# EasyEDA schematic Solder practice.json
TITLE: Solder practice; REV: 1.0; Date: 2023-02-27; Sheet: 1/1; Drawn By: philbobagins
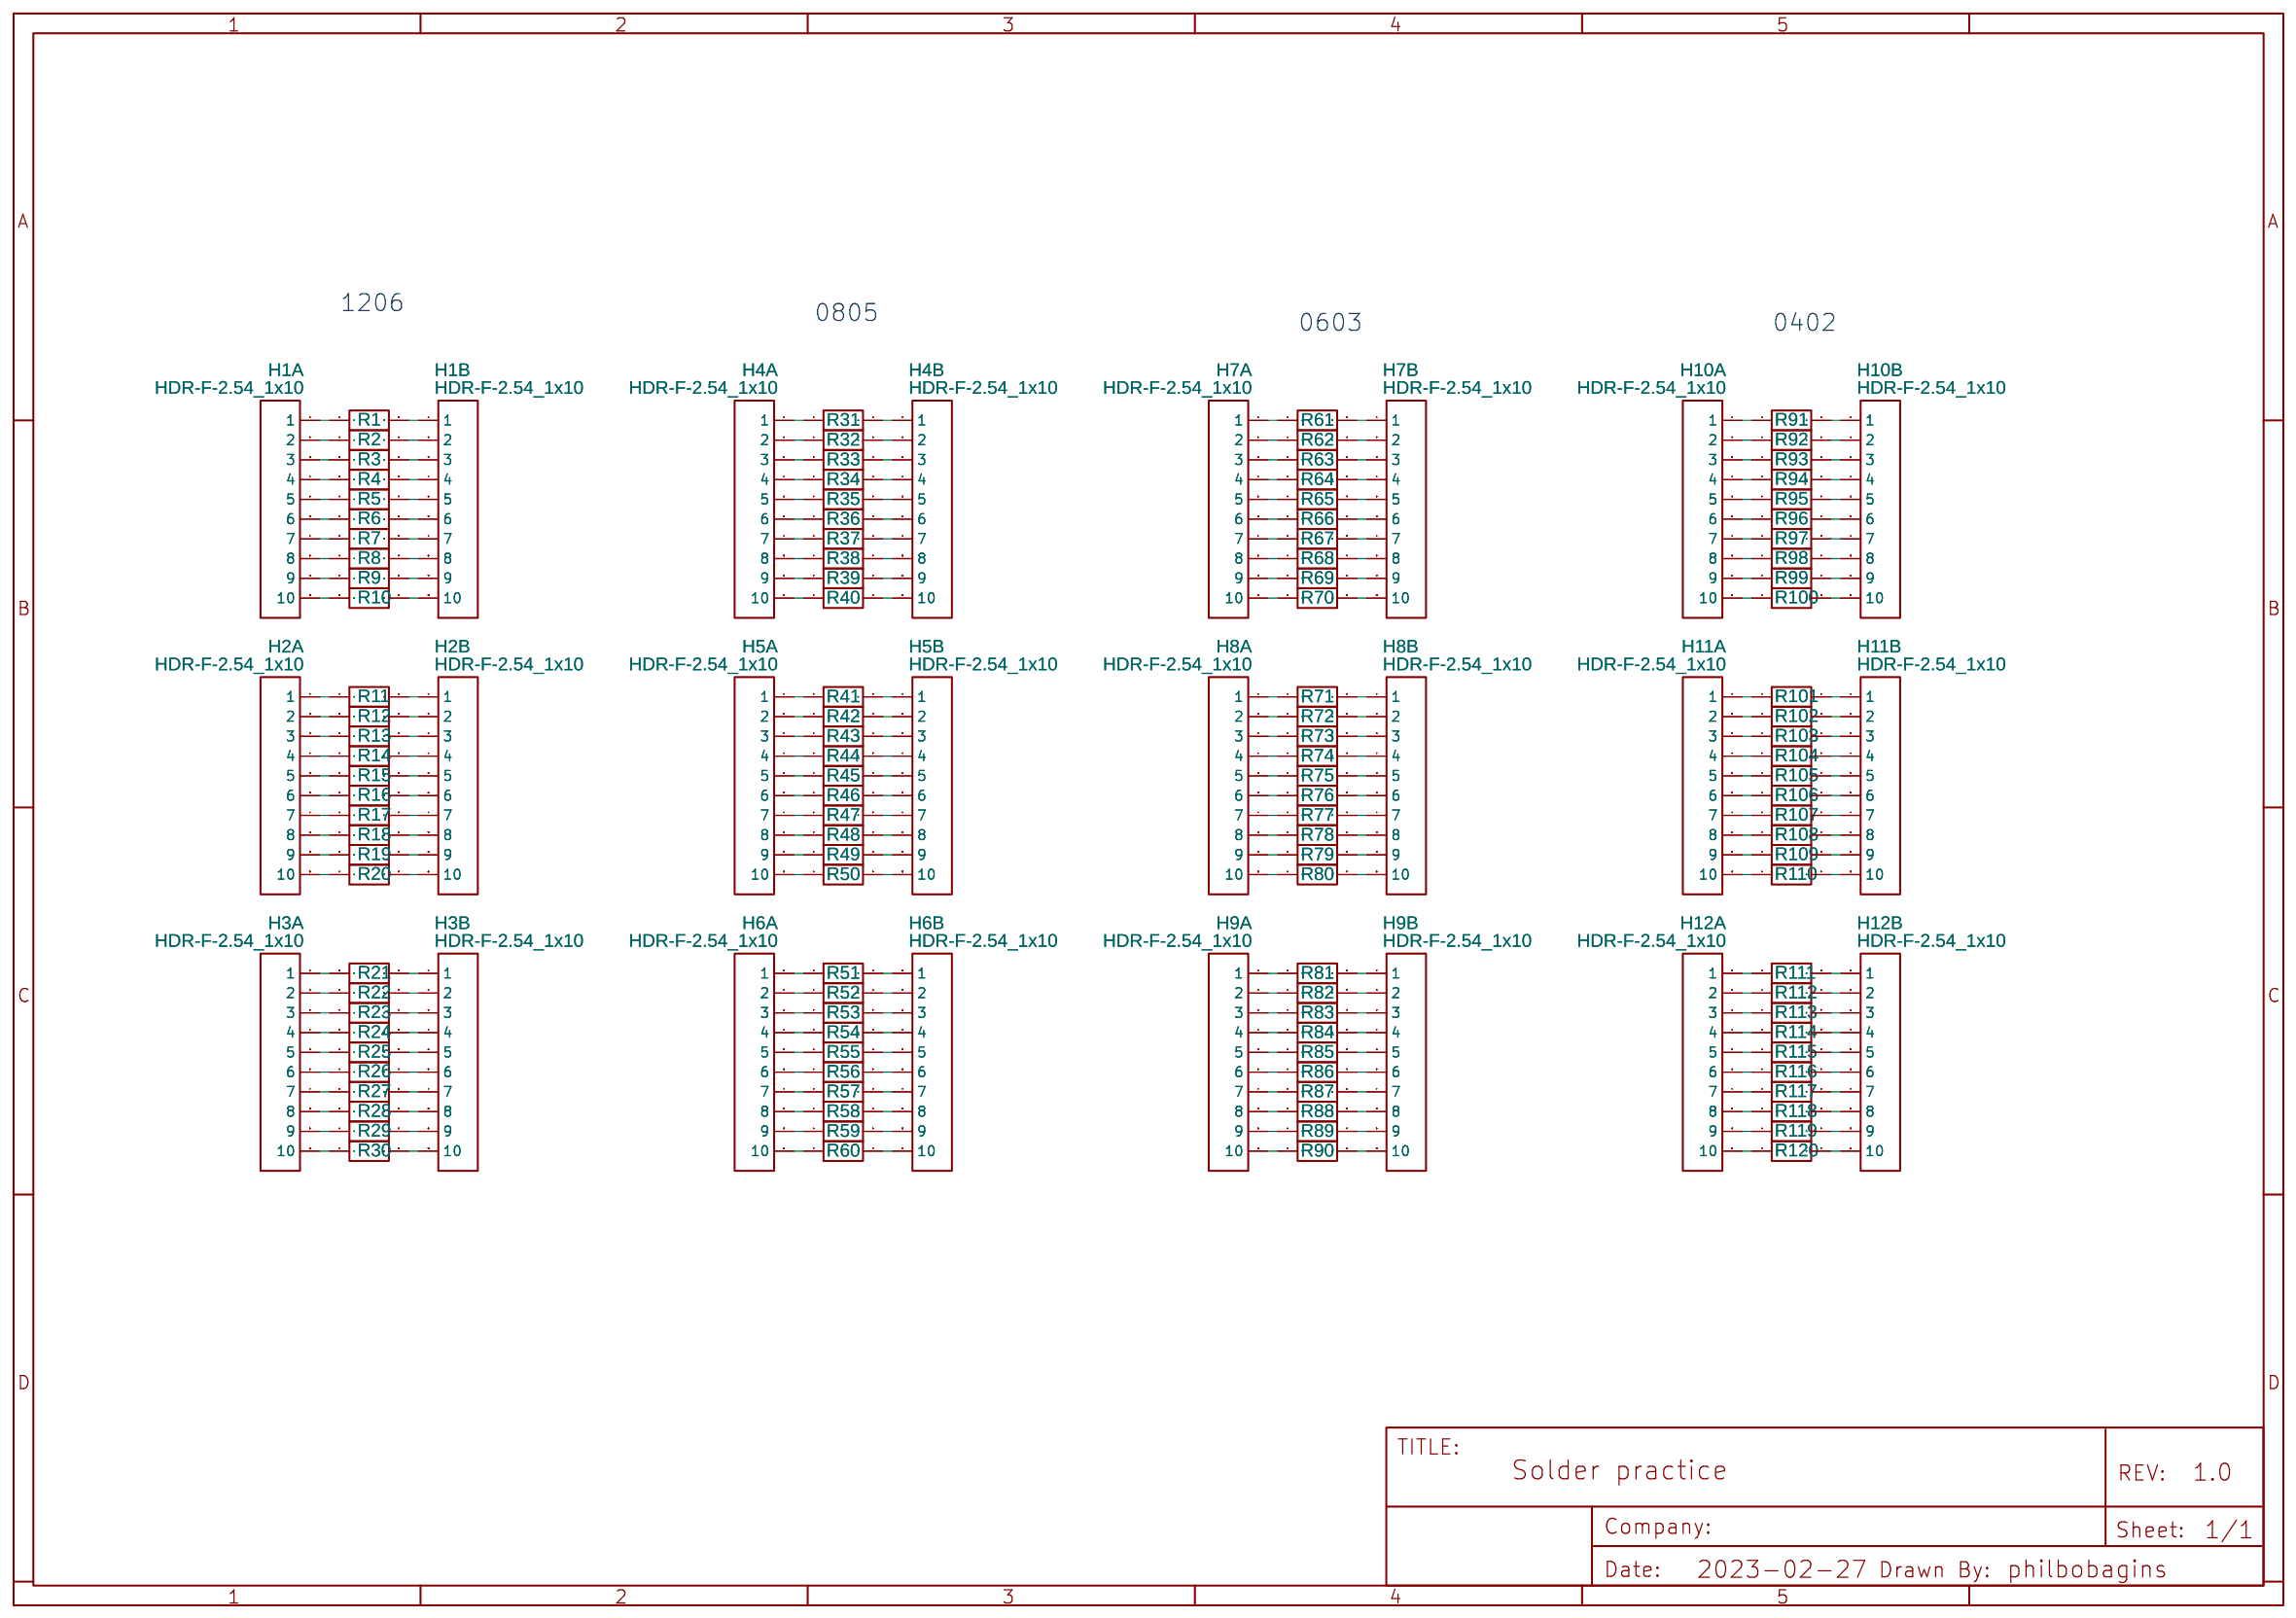
[diagram p0: schematic sheet]

## Parts
H1A  HDR-F-2.54_1x10  [HDR-F-2.54_1X10]
H1B  HDR-F-2.54_1x10  [HDR-F-2.54_1X10]
H2A  HDR-F-2.54_1x10  [HDR-F-2.54_1X10]
H2B  HDR-F-2.54_1x10  [HDR-F-2.54_1X10]
H3A  HDR-F-2.54_1x10  [HDR-F-2.54_1X10]
H3B  HDR-F-2.54_1x10  [HDR-F-2.54_1X10]
H4A  HDR-F-2.54_1x10  [HDR-F-2.54_1X10]
H4B  HDR-F-2.54_1x10  [HDR-F-2.54_1X10]
H5A  HDR-F-2.54_1x10  [HDR-F-2.54_1X10]
H5B  HDR-F-2.54_1x10  [HDR-F-2.54_1X10]
H6A  HDR-F-2.54_1x10  [HDR-F-2.54_1X10]
H6B  HDR-F-2.54_1x10  [HDR-F-2.54_1X10]
H7A  HDR-F-2.54_1x10  [HDR-F-2.54_1X10]
H7B  HDR-F-2.54_1x10  [HDR-F-2.54_1X10]
H8A  HDR-F-2.54_1x10  [HDR-F-2.54_1X10]
H8B  HDR-F-2.54_1x10  [HDR-F-2.54_1X10]
H9A  HDR-F-2.54_1x10  [HDR-F-2.54_1X10]
H9B  HDR-F-2.54_1x10  [HDR-F-2.54_1X10]
H10A  HDR-F-2.54_1x10  [HDR-F-2.54_1X10]
H10B  HDR-F-2.54_1x10  [HDR-F-2.54_1X10]
H11A  HDR-F-2.54_1x10  [HDR-F-2.54_1X10]
H11B  HDR-F-2.54_1x10  [HDR-F-2.54_1X10]
H12A  HDR-F-2.54_1x10  [HDR-F-2.54_1X10]
H12B  HDR-F-2.54_1x10  [HDR-F-2.54_1X10]
R1  1k  [R1206]
R2  1k  [R1206]
R3  1k  [R1206]
R4  1k  [R1206]
R5  1k  [R1206]
R6  1k  [R1206]
R7  1k  [R1206]
R8  1k  [R1206]
R9  1k  [R1206]
R10  1k  [R1206]
R11  1k  [R1206]
R12  1k  [R1206]
R13  1k  [R1206]
R14  1k  [R1206]
R15  1k  [R1206]
R16  1k  [R1206]
R17  1k  [R1206]
R18  1k  [R1206]
R19  1k  [R1206]
R20  1k  [R1206]
R21  1k  [R1206]
R22  1k  [R1206]
R23  1k  [R1206]
R24  1k  [R1206]
R25  1k  [R1206]
R26  1k  [R1206]
R27  1k  [R1206]
R28  1k  [R1206]
R29  1k  [R1206]
R30  1k  [R1206]
R31  1k  [R0805]
R32  1k  [R0805]
R33  1k  [R0805]
R34  1k  [R0805]
R35  1k  [R0805]
R36  1k  [R0805]
R37  1k  [R0805]
R38  1k  [R0805]
R39  1k  [R0805]
R40  1k  [R0805]
R41  1k  [R0805]
R42  1k  [R0805]
R43  1k  [R0805]
R44  1k  [R0805]
R45  1k  [R0805]
R46  1k  [R0805]
R47  1k  [R0805]
R48  1k  [R0805]
R49  1k  [R0805]
R50  1k  [R0805]
R51  1k  [R0805]
R52  1k  [R0805]
R53  1k  [R0805]
R54  1k  [R0805]
R55  1k  [R0805]
R56  1k  [R0805]
R57  1k  [R0805]
R58  1k  [R0805]
R59  1k  [R0805]
R60  1k  [R0805]
R61  1k  [R0603]
R62  1k  [R0603]
R63  1k  [R0603]
R64  1k  [R0603]
R65  1k  [R0603]
R66  1k  [R0603]
R67  1k  [R0603]
R68  1k  [R0603]
R69  1k  [R0603]
R70  1k  [R0603]
R71  1k  [R0603]
R72  1k  [R0603]
R73  1k  [R0603]
R74  1k  [R0603]
R75  1k  [R0603]
R76  1k  [R0603]
R77  1k  [R0603]
R78  1k  [R0603]
R79  1k  [R0603]
R80  1k  [R0603]
R81  1k  [R0603]
R82  1k  [R0603]
R83  1k  [R0603]
R84  1k  [R0603]
R85  1k  [R0603]
R86  1k  [R0603]
R87  1k  [R0603]
R88  1k  [R0603]
R89  1k  [R0603]
R90  1k  [R0603]
R91  1k  [R0402]
R92  1k  [R0402]
R93  1k  [R0402]
R94  1k  [R0402]
R95  1k  [R0402]
R96  1k  [R0402]
R97  1k  [R0402]
R98  1k  [R0402]
R99  1k  [R0402]
R100  1k  [R0402]
R101  1k  [R0402]
R102  1k  [R0402]
R103  1k  [R0402]
R104  1k  [R0402]
R105  1k  [R0402]
R106  1k  [R0402]
R107  1k  [R0402]
R108  1k  [R0402]
R109  1k  [R0402]
R110  1k  [R0402]
R111  1k  [R0402]
R112  1k  [R0402]
R113  1k  [R0402]
R114  1k  [R0402]
R115  1k  [R0402]
R116  1k  [R0402]
R117  1k  [R0402]
R118  1k  [R0402]
R119  1k  [R0402]
R120  1k  [R0402]

## Library data of the parts
H1A H1B H2A H2B H3A H3B H4A H4B H5A H5B H6A H6B H7A H7B H8A H8B H9A H9B H10A H10B H11A H11B H12A H12B = HDR-F-2.54_1x10: Supplier Part: C35445; Supplier: LCSC; Contributor: LCEDA_Lib
R1-R30 = R_1206_EU: Contributor: LCEDA_Lib
R31-R60 = R_0805_EU: Contributor: LCEDA_Lib
R61-R90 = R_0603_EU: Contributor: LCEDA_Lib
R91-R120 = R_0402_EU: Contributor: LCEDA_Lib

## Nets
Net-(H1A-1): H1A.1 R1.1
Net-(H1A-2): H1A.2 R2.1
Net-(H1A-3): H1A.3 R3.1
Net-(H1A-4): H1A.4 R4.1
Net-(H1A-5): H1A.5 R5.1
Net-(H1A-6): H1A.6 R6.1
Net-(H1A-7): H1A.7 R7.1
Net-(H1A-8): H1A.8 R8.1
Net-(H1A-9): H1A.9 R9.1
Net-(H1A-10): H1A.10 R10.1
Net-(H1B-1): H1B.1 R1.2
Net-(H1B-2): H1B.2 R2.2
Net-(H1B-3): H1B.3 R3.2
Net-(H1B-4): H1B.4 R4.2
Net-(H1B-5): H1B.5 R5.2
Net-(H1B-6): H1B.6 R6.2
Net-(H1B-7): H1B.7 R7.2
Net-(H1B-8): H1B.8 R8.2
Net-(H1B-9): H1B.9 R9.2
Net-(H1B-10): H1B.10 R10.2
Net-(H2A-1): H2A.1 R11.1
Net-(H2A-2): H2A.2 R12.1
Net-(H2A-3): H2A.3 R13.1
Net-(H2A-4): H2A.4 R14.1
Net-(H2A-5): H2A.5 R15.1
Net-(H2A-6): H2A.6 R16.1
Net-(H2A-7): H2A.7 R17.1
Net-(H2A-8): H2A.8 R18.1
Net-(H2A-9): H2A.9 R19.1
Net-(H2A-10): H2A.10 R20.1
Net-(H2B-1): H2B.1 R11.2
Net-(H2B-2): H2B.2 R12.2
Net-(H2B-3): H2B.3 R13.2
Net-(H2B-4): H2B.4 R14.2
Net-(H2B-5): H2B.5 R15.2
Net-(H2B-6): H2B.6 R16.2
Net-(H2B-7): H2B.7 R17.2
Net-(H2B-8): H2B.8 R18.2
Net-(H2B-9): H2B.9 R19.2
Net-(H2B-10): H2B.10 R20.2
Net-(H3A-1): H3A.1 R21.1
Net-(H3A-2): H3A.2 R22.1
Net-(H3A-3): H3A.3 R23.1
Net-(H3A-4): H3A.4 R24.1
Net-(H3A-5): H3A.5 R25.1
Net-(H3A-6): H3A.6 R26.1
Net-(H3A-7): H3A.7 R27.1
Net-(H3A-8): H3A.8 R28.1
Net-(H3A-9): H3A.9 R29.1
Net-(H3A-10): H3A.10 R30.1
Net-(H3B-1): H3B.1 R21.2
Net-(H3B-2): H3B.2 R22.2
Net-(H3B-3): H3B.3 R23.2
Net-(H3B-4): H3B.4 R24.2
Net-(H3B-5): H3B.5 R25.2
Net-(H3B-6): H3B.6 R26.2
Net-(H3B-7): H3B.7 R27.2
Net-(H3B-8): H3B.8 R28.2
Net-(H3B-9): H3B.9 R29.2
Net-(H3B-10): H3B.10 R30.2
Net-(H4A-1): H4A.1 R31.1
Net-(H4A-2): H4A.2 R32.1
Net-(H4A-3): H4A.3 R33.1
Net-(H4A-4): H4A.4 R34.1
Net-(H4A-5): H4A.5 R35.1
Net-(H4A-6): H4A.6 R36.1
Net-(H4A-7): H4A.7 R37.1
Net-(H4A-8): H4A.8 R38.1
Net-(H4A-9): H4A.9 R39.1
Net-(H4A-10): H4A.10 R40.1
Net-(H4B-1): H4B.1 R31.2
Net-(H4B-2): H4B.2 R32.2
Net-(H4B-3): H4B.3 R33.2
Net-(H4B-4): H4B.4 R34.2
Net-(H4B-5): H4B.5 R35.2
Net-(H4B-6): H4B.6 R36.2
Net-(H4B-7): H4B.7 R37.2
Net-(H4B-8): H4B.8 R38.2
Net-(H4B-9): H4B.9 R39.2
Net-(H4B-10): H4B.10 R40.2
Net-(H5A-1): H5A.1 R41.1
Net-(H5A-2): H5A.2 R42.1
Net-(H5A-3): H5A.3 R43.1
Net-(H5A-4): H5A.4 R44.1
Net-(H5A-5): H5A.5 R45.1
Net-(H5A-6): H5A.6 R46.1
Net-(H5A-7): H5A.7 R47.1
Net-(H5A-8): H5A.8 R48.1
Net-(H5A-9): H5A.9 R49.1
Net-(H5A-10): H5A.10 R50.1
Net-(H5B-1): H5B.1 R41.2
Net-(H5B-2): H5B.2 R42.2
Net-(H5B-3): H5B.3 R43.2
Net-(H5B-4): H5B.4 R44.2
Net-(H5B-5): H5B.5 R45.2
Net-(H5B-6): H5B.6 R46.2
Net-(H5B-7): H5B.7 R47.2
Net-(H5B-8): H5B.8 R48.2
Net-(H5B-9): H5B.9 R49.2
Net-(H5B-10): H5B.10 R50.2
Net-(H6A-1): H6A.1 R51.1
Net-(H6A-2): H6A.2 R52.1
Net-(H6A-3): H6A.3 R53.1
Net-(H6A-4): H6A.4 R54.1
Net-(H6A-5): H6A.5 R55.1
Net-(H6A-6): H6A.6 R56.1
Net-(H6A-7): H6A.7 R57.1
Net-(H6A-8): H6A.8 R58.1
Net-(H6A-9): H6A.9 R59.1
Net-(H6A-10): H6A.10 R60.1
Net-(H6B-1): H6B.1 R51.2
Net-(H6B-2): H6B.2 R52.2
Net-(H6B-3): H6B.3 R53.2
Net-(H6B-4): H6B.4 R54.2
Net-(H6B-5): H6B.5 R55.2
Net-(H6B-6): H6B.6 R56.2
Net-(H6B-7): H6B.7 R57.2
Net-(H6B-8): H6B.8 R58.2
Net-(H6B-9): H6B.9 R59.2
Net-(H6B-10): H6B.10 R60.2
Net-(H7A-1): H7A.1 R61.1
Net-(H7A-2): H7A.2 R62.1
Net-(H7A-3): H7A.3 R63.1
Net-(H7A-4): H7A.4 R64.1
Net-(H7A-5): H7A.5 R65.1
Net-(H7A-6): H7A.6 R66.1
Net-(H7A-7): H7A.7 R67.1
Net-(H7A-8): H7A.8 R68.1
Net-(H7A-9): H7A.9 R69.1
Net-(H7A-10): H7A.10 R70.1
Net-(H7B-1): H7B.1 R61.2
Net-(H7B-2): H7B.2 R62.2
Net-(H7B-3): H7B.3 R63.2
Net-(H7B-4): H7B.4 R64.2
Net-(H7B-5): H7B.5 R65.2
Net-(H7B-6): H7B.6 R66.2
Net-(H7B-7): H7B.7 R67.2
Net-(H7B-8): H7B.8 R68.2
Net-(H7B-9): H7B.9 R69.2
Net-(H7B-10): H7B.10 R70.2
Net-(H8A-1): H8A.1 R71.1
Net-(H8A-2): H8A.2 R72.1
Net-(H8A-3): H8A.3 R73.1
Net-(H8A-4): H8A.4 R74.1
Net-(H8A-5): H8A.5 R75.1
Net-(H8A-6): H8A.6 R76.1
Net-(H8A-7): H8A.7 R77.1
Net-(H8A-8): H8A.8 R78.1
Net-(H8A-9): H8A.9 R79.1
Net-(H8A-10): H8A.10 R80.1
Net-(H8B-1): H8B.1 R71.2
Net-(H8B-2): H8B.2 R72.2
Net-(H8B-3): H8B.3 R73.2
Net-(H8B-4): H8B.4 R74.2
Net-(H8B-5): H8B.5 R75.2
Net-(H8B-6): H8B.6 R76.2
Net-(H8B-7): H8B.7 R77.2
Net-(H8B-8): H8B.8 R78.2
Net-(H8B-9): H8B.9 R79.2
Net-(H8B-10): H8B.10 R80.2
Net-(H9A-1): H9A.1 R81.1
Net-(H9A-2): H9A.2 R82.1
Net-(H9A-3): H9A.3 R83.1
Net-(H9A-4): H9A.4 R84.1
Net-(H9A-5): H9A.5 R85.1
Net-(H9A-6): H9A.6 R86.1
Net-(H9A-7): H9A.7 R87.1
Net-(H9A-8): H9A.8 R88.1
Net-(H9A-9): H9A.9 R89.1
Net-(H9A-10): H9A.10 R90.1
Net-(H9B-1): H9B.1 R81.2
Net-(H9B-2): H9B.2 R82.2
Net-(H9B-3): H9B.3 R83.2
Net-(H9B-4): H9B.4 R84.2
Net-(H9B-5): H9B.5 R85.2
Net-(H9B-6): H9B.6 R86.2
Net-(H9B-7): H9B.7 R87.2
Net-(H9B-8): H9B.8 R88.2
Net-(H9B-9): H9B.9 R89.2
Net-(H9B-10): H9B.10 R90.2
Net-(H10A-1): H10A.1 R91.1
Net-(H10A-2): H10A.2 R92.1
Net-(H10A-3): H10A.3 R93.1
Net-(H10A-4): H10A.4 R94.1
Net-(H10A-5): H10A.5 R95.1
Net-(H10A-6): H10A.6 R96.1
Net-(H10A-7): H10A.7 R97.1
Net-(H10A-8): H10A.8 R98.1
Net-(H10A-9): H10A.9 R99.1
Net-(H10A-10): H10A.10 R100.1
Net-(H10B-1): H10B.1 R91.2
Net-(H10B-2): H10B.2 R92.2
Net-(H10B-3): H10B.3 R93.2
Net-(H10B-4): H10B.4 R94.2
Net-(H10B-5): H10B.5 R95.2
Net-(H10B-6): H10B.6 R96.2
Net-(H10B-7): H10B.7 R97.2
Net-(H10B-8): H10B.8 R98.2
Net-(H10B-9): H10B.9 R99.2
Net-(H10B-10): H10B.10 R100.2
Net-(H11A-1): H11A.1 R101.1
Net-(H11A-2): H11A.2 R102.1
Net-(H11A-3): H11A.3 R103.1
Net-(H11A-4): H11A.4 R104.1
Net-(H11A-5): H11A.5 R105.1
Net-(H11A-6): H11A.6 R106.1
Net-(H11A-7): H11A.7 R107.1
Net-(H11A-8): H11A.8 R108.1
Net-(H11A-9): H11A.9 R109.1
Net-(H11A-10): H11A.10 R110.1
Net-(H11B-1): H11B.1 R101.2
Net-(H11B-2): H11B.2 R102.2
Net-(H11B-3): H11B.3 R103.2
Net-(H11B-4): H11B.4 R104.2
Net-(H11B-5): H11B.5 R105.2
Net-(H11B-6): H11B.6 R106.2
Net-(H11B-7): H11B.7 R107.2
Net-(H11B-8): H11B.8 R108.2
Net-(H11B-9): H11B.9 R109.2
Net-(H11B-10): H11B.10 R110.2
Net-(H12A-1): H12A.1 R111.1
Net-(H12A-2): H12A.2 R112.1
Net-(H12A-3): H12A.3 R113.1
Net-(H12A-4): H12A.4 R114.1
Net-(H12A-5): H12A.5 R115.1
Net-(H12A-6): H12A.6 R116.1
Net-(H12A-7): H12A.7 R117.1
Net-(H12A-8): H12A.8 R118.1
Net-(H12A-9): H12A.9 R119.1
Net-(H12A-10): H12A.10 R120.1
Net-(H12B-1): H12B.1 R111.2
Net-(H12B-2): H12B.2 R112.2
Net-(H12B-3): H12B.3 R113.2
Net-(H12B-4): H12B.4 R114.2
Net-(H12B-5): H12B.5 R115.2
Net-(H12B-6): H12B.6 R116.2
Net-(H12B-7): H12B.7 R117.2
Net-(H12B-8): H12B.8 R118.2
Net-(H12B-9): H12B.9 R119.2
Net-(H12B-10): H12B.10 R120.2

## Notes on the sheet
- 1206
- 0805
- 0603
- 0402
